# Altium schematic sheet Sheet2.SchDoc: Alarm Board
size A3
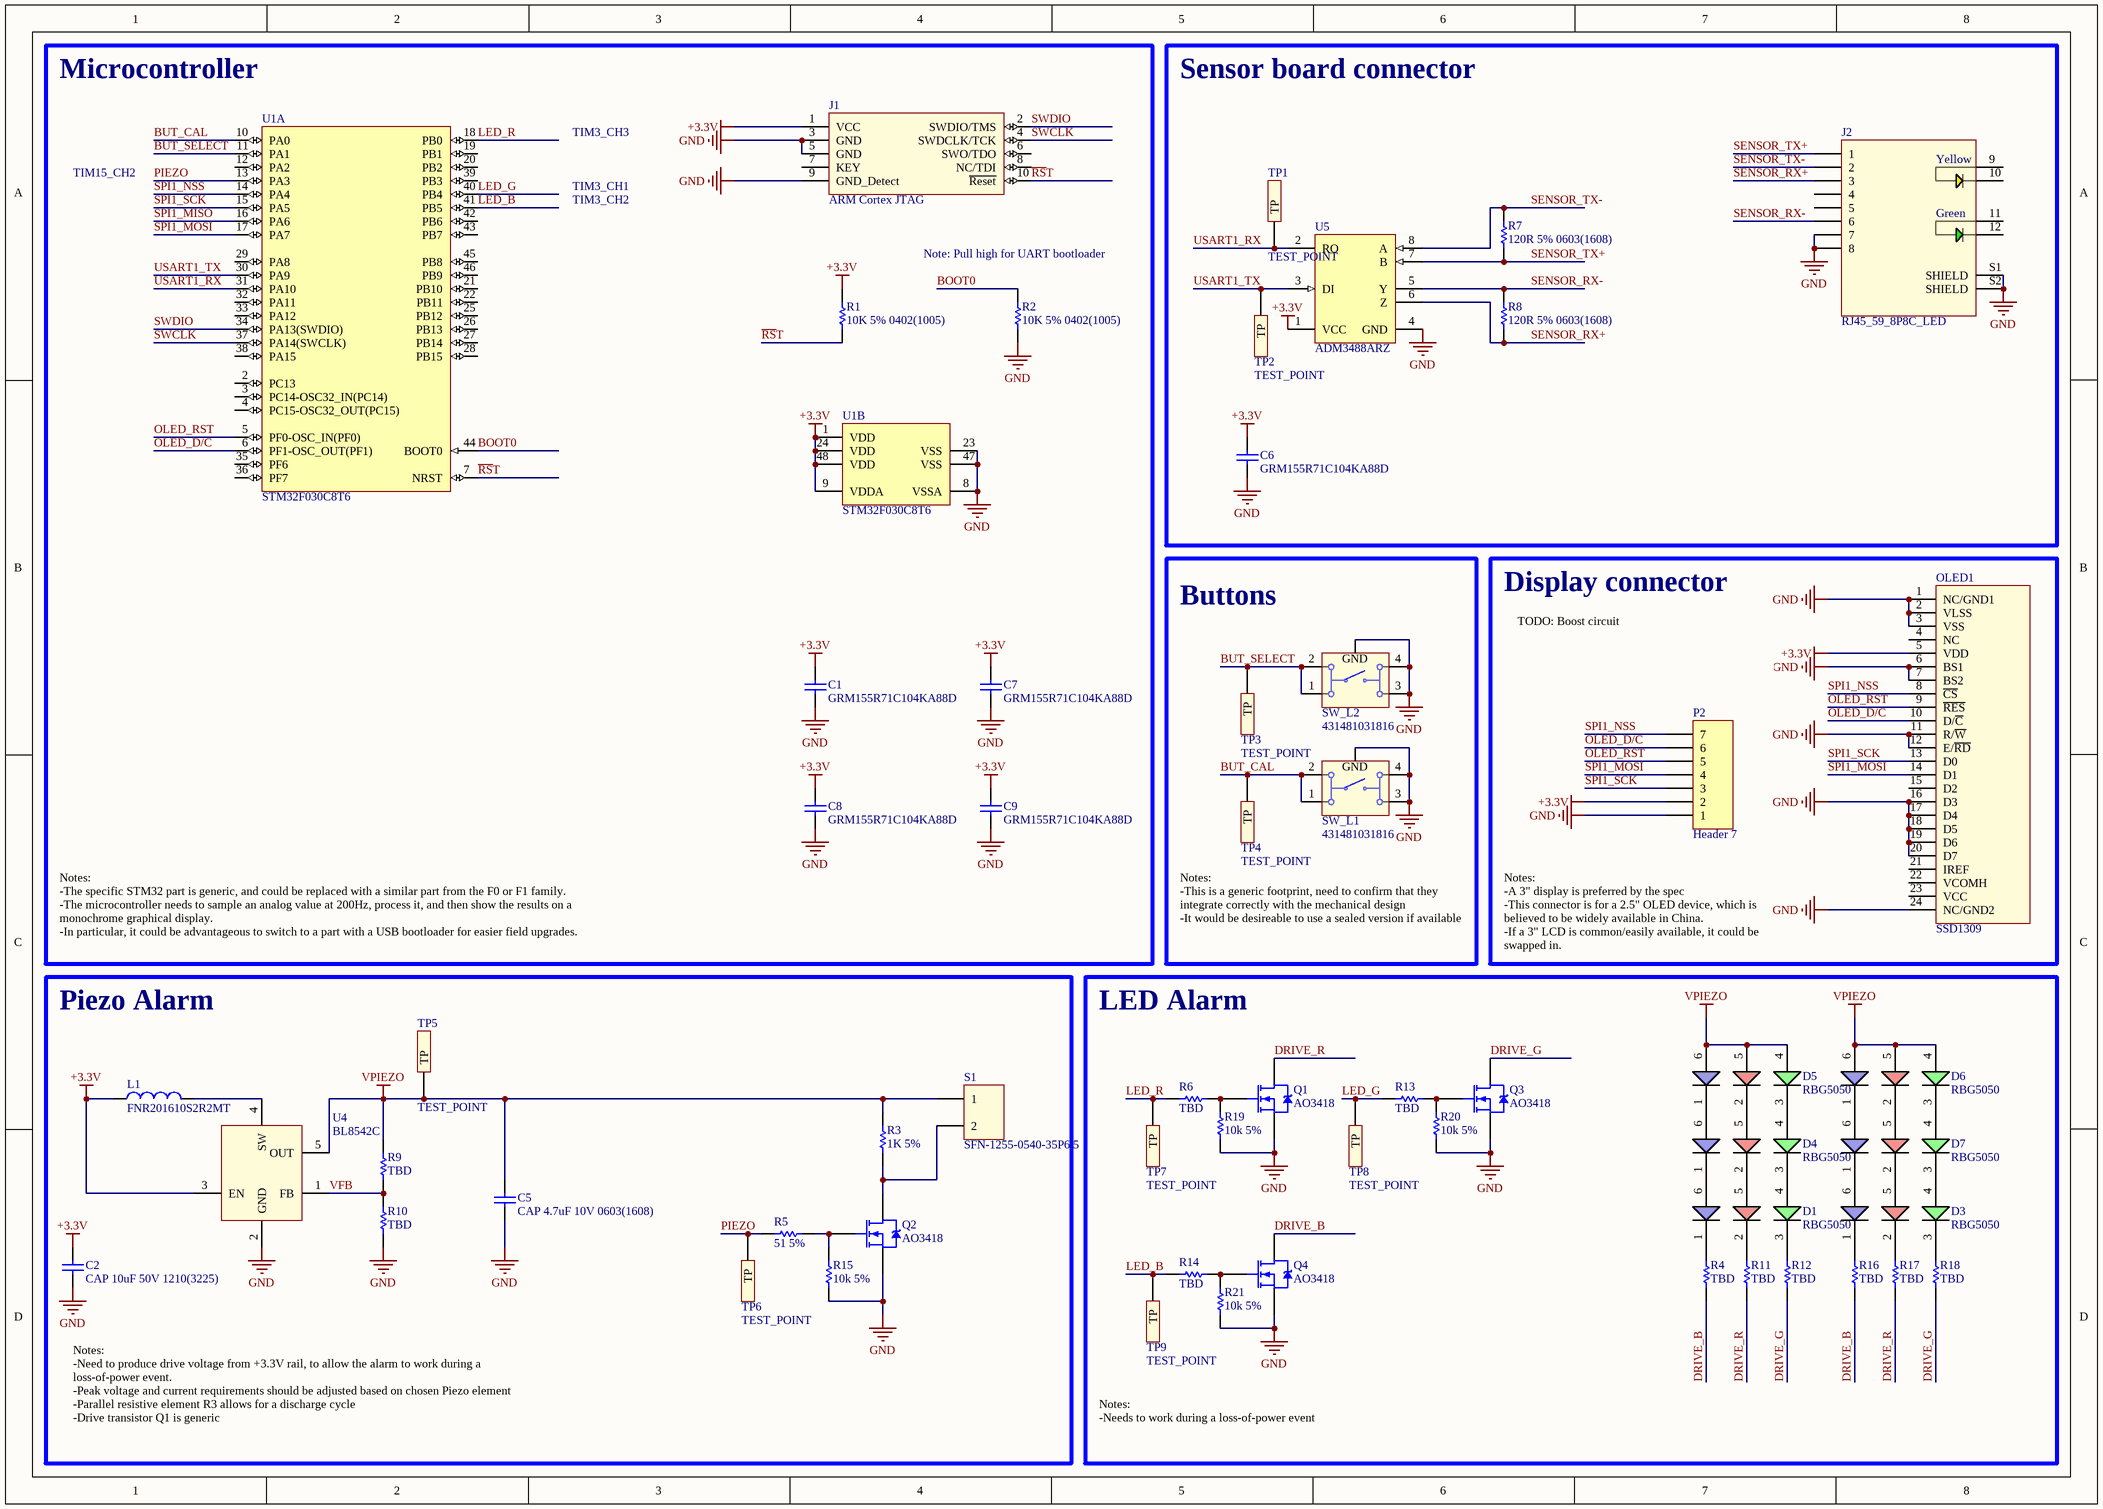
[diagram p0: Sheet2.SchDoc]

## Parts
C1  GRM155R71C104KA88D  [CAPC1005X55X25ML05T10]
C2  CAP 10uF 50V 1210(3225)  [CAPC1210(3225)190_N]
C5  CAP 4.7uF 10V 0603(1608)  [CAPC0603(1608)55_L]
C6  GRM155R71C104KA88D  [CAPC1005X55X25ML05T10]
C7  GRM155R71C104KA88D  [CAPC1005X55X25ML05T10]
C8  GRM155R71C104KA88D  [CAPC1005X55X25ML05T10]
C9  GRM155R71C104KA88D  [CAPC1005X55X25ML05T10]
D1  RBG5050  [5050RGB]
D3  RBG5050  [5050RGB]
D4  RBG5050  [5050RGB]
D5  RBG5050  [5050RGB]
D6  RBG5050  [5050RGB]
D7  RBG5050  [5050RGB]
J1  ARM Cortex JTAG  [1.27mm 2x5 SMD Header]
J2  RJ45_59_8P8C_LED  [RJ45_59_8P8C_LED]
L1  FNR201610S2R2MT  [FNR201610S]
OLED1  SSD1309
P2  Header 7  [HDR1X7]
Q1  AO3418  [SOT95P280X125-3N]
Q2  AO3418  [SOT95P280X125-3N]
Q3  AO3418  [SOT95P280X125-3N]
Q4  AO3418  [SOT95P280X125-3N]
R1  10K 5% 0402(1005)  [RESC0402(1005)_N]
R2  10K 5% 0402(1005)  [RESC0402(1005)_N]
R3  1K 5%  [RESC0402(1005)_N]
R4  TBD  [RESC0402(1005)_N]
R5  51 5%  [RESC0402(1005)_N]
R6  TBD  [RESC0402(1005)_N]
R7  120R 5% 0603(1608)  [RESC0603(1608)_L]
R8  120R 5% 0603(1608)  [RESC0603(1608)_L]
R9  TBD  [RESC0402(1005)_N]
R10  TBD  [RESC0402(1005)_N]
R11  TBD  [RESC0402(1005)_N]
R12  TBD  [RESC0402(1005)_N]
R13  TBD  [RESC0402(1005)_N]
R14  TBD  [RESC0402(1005)_N]
R15  10k 5%  [RESC0402(1005)_N]
R16  TBD  [RESC0402(1005)_N]
R17  TBD  [RESC0402(1005)_N]
R18  TBD  [RESC0402(1005)_N]
R19  10k 5%  [RESC0402(1005)_N]
R20  10k 5%  [RESC0402(1005)_N]
R21  10k 5%  [RESC0402(1005)_N]
S1  SFN-1255-0540-35P6.5  [SFN-1255-0540-35P6.5]
SW_L1  431481031816  [431481031816]
SW_L2  431481031816  [431481031816]
TP1  TEST_POINT  [TP-SMD-1mm]  (no BOM)
TP2  TEST_POINT  [TP-SMD-1mm]  (no BOM)
TP3  TEST_POINT  [TP-SMD-1mm]  (no BOM)
TP4  TEST_POINT  [TP-SMD-1mm]  (no BOM)
TP5  TEST_POINT  [TP-SMD-1mm]  (no BOM)
TP6  TEST_POINT  [TP-SMD-1mm]  (no BOM)
TP7  TEST_POINT  [TP-SMD-1mm]  (no BOM)
TP8  TEST_POINT  [TP-SMD-1mm]  (no BOM)
TP9  TEST_POINT  [TP-SMD-1mm]  (no BOM)
U1  STM32F030C8T6  [STM-LQFP48_M]  (parts A,B of 2)
U4  BL8542C  [SOT95P280X130-5N]
U5  ADM3488ARZ  [ADI-R-8_L]

## Blocks framed on the sheet
Microcontroller: C1 C7-C9 J1 R1 R2 U1
Sensor board connector: C6 J2 R7 R8 TP1 TP2 U5
Buttons: SW_L1 SW_L2 TP3 TP4
Display connector: OLED1 P2
Piezo Alarm: C2 C5 L1 Q2 R3 R5 R9 R10 R15 S1 TP5 TP6 U4
LED Alarm: D1 D3-D7 Q1 Q3 Q4 R4 R6 R11-R14 R16-R21 TP7-TP9

## Nets
+3.3V: C1.2 C2.2 C6.2 C7.2 C8.2 C9.2 J1.1(VCC) L1.1 OLED1.5(VDD) P2.2 R1.1 U1.1(VDD) U1.9(VDDA) U1.24(VDD) U1.48(VDD) U4.3(EN) U5.1(VCC)
GND: C1.1 C2.1 C5.1 C6.1 C7.1 C8.1 C9.1 J1.3(GND) J1.5(GND) J1.9(GND_Detect) J2.7 J2.8 J2.S1(SHIELD) J2.S2(SHIELD) OLED1.1(NC/GND1) OLED1.2(VLSS) OLED1.3(VSS) OLED1.6(BS1) OLED1.7(BS2) OLED1.11(R/~{W}) OLED1.12(E/~{RD}) OLED1.16(D3) OLED1.17(D4) OLED1.18(D5) OLED1.19(D6) OLED1.20(D7) OLED1.24(NC/GND2) P2.1 Q1.2(SOURCE) Q2.2(SOURCE) Q3.2(SOURCE) Q4.2(SOURCE) R2.2 R10.1 R15.1 R19.1 R20.1 R21.1 SW_L1.3 SW_L1.4 SW_L1.5 SW_L2.3 SW_L2.4 SW_L2.5 U1.8(VSSA) U1.23(VSS) U1.47(VSS) U4.2(GND) U5.4(GND)
VPIEZO: C5.2 D5.4 D5.5 D5.6 D6.4 D6.5 D6.6 R3.2 R9.2 S1.1 TP5.1(TP) U4.5(OUT)
~{RS}T: J1.10(~{Reset}) R1.2 U1.7(NRST)
BOOT0: R2.1 U1.44(BOOT0)
BUT_CAL: SW_L1.1 SW_L1.2 TP4.1(TP) U1.10(PA0)
BUT_SELECT: SW_L2.1 SW_L2.2 TP3.1(TP) U1.11(PA1)
DRIVE_B: Q4.3(DRAIN) R4.1 R16.1
DRIVE_G: Q3.3(DRAIN) R12.1 R18.1
DRIVE_R: Q1.3(DRAIN) R11.1 R17.1
LED_B: R14.1 TP9.1(TP) U1.41(PB5)
LED_G: R13.1 TP8.1(TP) U1.40(PB4)
LED_R: R6.1 TP7.1(TP) U1.18(PB0)
OLED_D/C: OLED1.10(D/~{C}) P2.6 U1.6(PF1-OSC_OUT(PF1))
OLED_RST: OLED1.9(~{RES}) P2.5 U1.5(PF0-OSC_IN(PF0))
PIEZO: R5.1 TP6.1(TP) U1.13(PA3)
SENSOR_RX+: J2.3 R8.1 U5.6(Z)
SENSOR_RX-: J2.6 R8.2 U5.5(Y)
SENSOR_TX+: J2.1 R7.1 U5.7(B)
SENSOR_TX-: J2.2 R7.2 U5.8(A)
SPI1_MISO: U1.16(PA6)
SPI1_MOSI: OLED1.14(D1) P2.4 U1.17(PA7)
SPI1_NSS: OLED1.8(~{CS}) P2.7 U1.14(PA4)
SPI1_SCK: OLED1.13(D0) P2.3 U1.15(PA5)
SWCLK: J1.4(SWDCLK/TCK) U1.37(PA14(SWCLK))
SWDIO: J1.2(SWDIO/TMS) U1.34(PA13(SWDIO))
USART1_RX: TP1.1(TP) U1.31(PA10) U5.2(RO)
USART1_TX: TP2.1(TP) U1.30(PA9) U5.3(DI)
VFB: R9.1 R10.2 U4.1(FB)
NetD1_1: D1.1 R4.2
NetD1_2: D1.2 R11.2
NetD1_3: D1.3 R12.2
NetD1_4: D1.4 D4.3
NetD1_5: D1.5 D4.2
NetD1_6: D1.6 D4.1
NetD3_1: D3.1 R16.2
NetD3_2: D3.2 R17.2
NetD3_3: D3.3 R18.2
NetD3_4: D3.4 D7.3
NetD3_5: D3.5 D7.2
NetD3_6: D3.6 D7.1
NetD4_4: D4.4 D5.3
NetD4_5: D4.5 D5.2
NetD4_6: D4.6 D5.1
NetD6_1: D6.1 D7.6
NetD6_2: D6.2 D7.5
NetD6_3: D6.3 D7.4
NetL1_2: L1.2 U4.4(SW)
NetQ1_1: Q1.1(GATE) R6.2 R19.2
NetQ2_1: Q2.1(GATE) R5.2 R15.2
NetQ2_3: Q2.3(DRAIN) R3.1 S1.2
NetQ3_1: Q3.1(GATE) R13.2 R20.2
NetQ4_1: Q4.1(GATE) R14.2 R21.2

Not connected (* = marked no-connect by the designer): J1 6(SWO/TDO) 7(KEY) 8(NC/TDI); J2 4 5 9(Yellow_Anode) 10(Yellow_Cathode) 11(Green_Anode) 12(Green_Cathode); OLED1 4(NC) 15(D2) 21(IREF) 22(VCOMH) 23(VCC); U1 2(PC13) 3(PC14-OSC32_IN(PC14)) 4(PC15-OSC32_OUT(PC15)) 12(PA2) 19(PB1) 20(PB2) 21(PB10) 22(PB11) 25(PB12) 26(PB13) 27(PB14) 28(PB15) 29(PA8) 32(PA11) 33(PA12) 35(PF6) 36(PF7) 38(PA15) 39(PB3) 42(PB6) 43(PB7) 45(PB8) 46(PB9)

## Notes on the sheet
- TIM15_CH2
- TIM3_CH3
- TIM3_CH1
- TIM3_CH2
- (near R2) Note: Pull high for UART bootloader
- (near P2) TODO: Boost circuit
- Notes:
  -The specific STM32 part is generic, and could be replaced with a similar part from the F0 or F1 family.
  -The microcontroller needs to sample an analog value at 200Hz, process it, and then show the results on a monochrome graphical display.
  -In particular, it could be advantageous to switch to a part with a USB bootloader for easier field upgrades.
- Notes:
  -This is a generic footprint, need to confirm that they integrate correctly with the mechanical design
  -It would be desireable to use a sealed version if available
- Notes:
  -A 3" display is preferred by the spec
  -This connector is for a 2.5" OLED device, which is believed to be widely available in China.
  -If a 3" LCD is common/easily available, it could be swapped in.
- Notes:
  -Need to produce drive voltage from +3.3V rail, to allow the alarm to work during a loss-of-power event.
  -Peak voltage and current requirements should be adjusted based on chosen Piezo element
  -Parallel resistive element R3 allows for a discharge cycle
  -Drive transistor Q1 is generic
- Notes:
  -Needs to work during a loss-of-power event
- Title:
- Project:
- Revision:
- Date:
- Time:
- Sheet
- of
- (in symbol CMP-1457-00011-1) GND
- (in symbol RJ45_59_8P8C_LED) Yellow; Green

## Library data of the parts
C1 C6-C9 = CMP-2100-03641-1: Chip Capacitor, 0.1 uF, +/- 10%, 16 V, -55 to 125 degC, 0402 (1005 Metric), RoHS, Tape and Reel; Manufacturer: Murata; Material: Ceramic; Insulation Resistance: 10GR; Voltage: 16V; Dielectric: X7R; Capacitance: 100nF; REACH SVHC: NoSVHC; Depth: 0.5mm; Case/Package: 0402; Datasheet URL: http://psearch.en.murata.com/capacitor/product/GRM155R71C104KA88%23.pdf; Lead Free: LeadFree; Dielectric Material: Ceramic; Manufacturer URL: http://www.murata.com/; Min Operating Temperature: -55degC; Length: 1mm; Case Code (Metric): 1005; Radiation Hardening: No; Package Reference: 0402; RoHSCompliant: true; Datasheet Version: 42675.0; Thickness: 0.022inch; Packaging: TapeandReel; Voltage Rating (DC): 16V; Tolerance: 10%; Max Operating Temperature: 125degC; Package Description: 2-Pin Surface Mount Device, Body 1 x 0.5 mm; Mount: SurfaceMount; Height: 0.5mm; Width: 0.5mm; Number of Pins: 2; Voltage Rating: 16V; Case Code (Imperial): 0402; Termination: SMD/SMT; Package Quantity: 1
C2 = CMP-1038-02238-1: CAP 10uF 50V -20% to +80% 1210 (3225 Metric) Thickness 1.9mm SMD; Case-Metric: 3225; Case-EIA: 1210; Rated Voltage: 50 V; Tolerance: -20% to +80%; Technology: SMT; Value: 10uF; Max Thickness: 1.9 mm
C5 = CMP-1035-02784-1: CAP 4.7uF 10V ±10% 0603 (1608 Metric) Thickness 0.55mm SMD; Case-Metric: 1608; Tolerance: Â±10%; Case-EIA: 0603; Technology: SMT; Max Thickness: 0.55 mm; Value: 4.7uF; Rated Voltage: 10 V
D1 D3-D7 = RBG5050: Generic RGB LED in 5050 package. Note that several variants exist, so check the pinout!; PartNumber: Unknown/Generic; Manufacturer: Unknown/Generic
J1 = ARM Cortex JTAG: Arm Cortex 10-pin JTAG connector; Manufacturer: Unknown/Generic; PartNumber: unknown/Generic
J2 = RJ45_59_8P8C_LED: Generic RJ49 jack with LED and without magnetics; Manufacturer: Unknown/Generic; PartNumber: RJ45_59_8P8C_LED
L1 = FNR201610S2R2MT: Wire Wound SMD Power Inductors 2.0×1.6×1.0 2.2uH
OLED1 = SSD1309: 2.4" OLED display, 24-pin connector, SSD1309 driver IC
P2 = Header 7: Header, 7-Pin; LatestRevisionDate: 17-Jul-2002; LatestRevisionNote: Re-released for DXP Platform.; Publisher: Altium Limited
Q1-Q4 = AO3418: 30V N-Channel MOSFET; Manufacturer: Alpha & Omega; ComponentLink1Description: datasheet; ComponentLink1URL: ao3418.pdf; PartNumber: AO3418
R1-R6 R9-R21 = CMP-1011-00098-1: 10K 0.063W 5% 0402 (1005 Metric)  SMD; Case-Metric: 1005; Value: 10000.00 Ohm; Case-EIA: 0402; Technology: SMT; Tolerance: 5 %; Power: 0.063 W
R7 R8 = CMP-1012-00052-1: 120R 0.1W 5% 0603 (1608 Metric)  SMD; Case-EIA: 0603; Value: 120.00 Ohm; Case-Metric: 1608; Technology: SMT; Power: 0.1 W; Tolerance: 5 %
S1 = SFN-1255-0540-35P6.5: Piezo Buzzer, 4KHz; Manufacturer: S&S; PartNumber: SFN-1255-0540-35P6.5
SW_L1 SW_L2 = CMP-1457-00011-1: WS-TASV SMD Tact Switch 6X6 mm with ground terminal; Manufacturer: Wuerth Elektronik; NoPins: 04; ComponentLink1URL: http://www.we-online.com; ComponentLink2URL: http://katalog.we-online.de/em/datasheet/431481031816.pdf; PackageReference: 431481031816; PartNumber: 431481031816; ComponentLink1Description: Manufacturer URL; ComponentLink2Description: Datasheet
TP1-TP9 = TEST_POINT: Test point
U1 = CMP-0304-00024-2: ARM Cortex-M0 32-bit MCU, 64 KB Flash, 8 KB Internal RAM, 39 I/Os, 48-pin LQFP, -40 to 85 degC, Tray; FLASH Size (Prog) (kB): 64; I/Os (High Current): 39; Operating Frequency(F) (Processor speed) (MHz): 48; Supply Voltage(Vcc) min (V): 2.4; Internal RAM Size (kB): 8; Packing: Tray; ComponentLink2URL: http://www.st.com/st-web-ui/static/active/en/resource/technical/document/datasheet/DM00088500.pdf; PackageVersion: Rev. 6, 06/2013; ComponentLink2Description: Datasheet; PartNumber: STM32F030C8T6; PackageDescription: 48-Pin Low Profile Quad Flat Package, 7 x 7 mm Body, 0.5 mm Pitch; Mounting Technology: Surface Mount; ComponentLink1URL: http://www.st.com/web/en/home.html; PackageReference: LQFP48; ComponentLink3URL: http://www.st.com/st-web-ui/static/active/en/resource/technical/document/datasheet/DM00058181.pdf; DatasheetVersion: Rev. 1; Core: ARM Cortex-M0; ComponentLink1Description: Manufacturer URL; ComponentLink3Description: Package Specification
U4 = BL8542C: 0.85V startup, 1MHz, 300mA Iout,  Synchronous Boost Converter (adjustable output); Manufacturer: Belling; PartNumber: BL8542C
U5 = CMP-0535-00058-1: 3.3 V Slew Rate Limited, Full-Duplex, RS-485/RS-422 Transceivers, 3 to 3.6 V, -40 to 85 degC, 8-Pin SOIC (R-8), RoHS, Tube; Manufacturer: Analog Devices; Guaranteed Data Rate: 0.25 Mbps; Receiver Hysteresis: 50 mV; Number of Drivers: 1; Duplex: Full; ComponentLink2URL: http://www.analog.com/static/imported-files/data_sheets/ADM3483_3485_3488_3490_3491.pdf; Mounting Technology: Surface Mount; RoHS: TRUE; ComponentLink2Description: Datasheet; ComponentLink3URL: http://www.analog.com/media/en/package-pcb-resources/package/pkg_pdf/soic_narrow-r/r_8.pdf; ComponentLink3Description: Package Specification; DatasheetVersion: Rev. E; PackageDescription: 8-Pin Standard Small Outline Package, Body 4.9 x 3.9 mm, Pitch 1.27 mm; ComponentLink1Description: Manufacturer URL; Supply Voltage: 3 to 3.6 V; PackageVersion: 06/2006; PartNumber: ADM3488ARZ; Packing: Tube; ComponentLink1URL: http://www.analog.com/en/index.html; Temperature Range: -40 to 85 degC